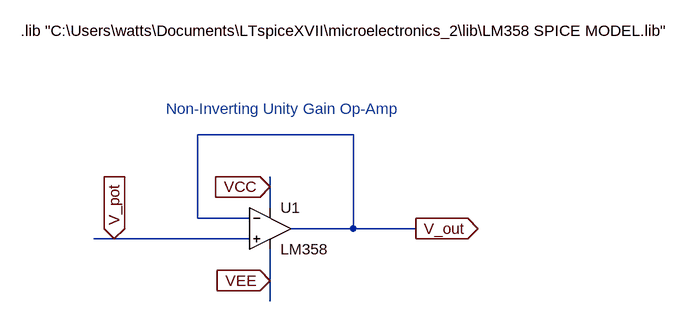
[diagram p0: schematic unity_gain_op_amp.asc]
unity_gain_op_amp.asc, the LTspice schematic file:
Version 4
SHEET 1 1560 808
WIRE 768 32 528 32
WIRE 640 112 640 96
WIRE 640 144 640 112
WIRE 528 160 528 32
WIRE 608 160 528 160
WIRE 768 176 768 32
WIRE 768 176 672 176
WIRE 864 176 768 176
WIRE 400 192 368 192
WIRE 608 192 400 192
WIRE 640 256 640 208
WIRE 640 288 640 256
FLAG 400 192 V_pot
IOPIN 400 192 In
FLAG 864 176 V_out
IOPIN 864 176 Out
FLAG 640 256 VEE
IOPIN 640 256 In
FLAG 640 112 VCC
IOPIN 640 112 In
SYMBOL OpAmps\\opamp2 640 112 R0
SYMATTR InstName U1
SYMATTR Value LM358
TEXT 256 -128 Left 2 !.lib "C:\\Users\\watts\\Documents\\LTspiceXVII\\microelectronics_2\\lib\\LM358 SPICE MODEL.lib"
TEXT 480 -8 Left 2 ;Non-Inverting Unity Gain Op-Amp

The netlist it stands for:
* unity_gain_op_amp.asc
XU1 V_pot V_out VCC VEE V_out LM358  ; pins In+ In- V+ V- OUT
.lib "C:\Users\watts\Documents\LTspiceXVII\microelectronics_2\lib\LM358 SPICE MODEL.lib"
* Non-Inverting Unity Gain Op-Amp
.backanno
.end